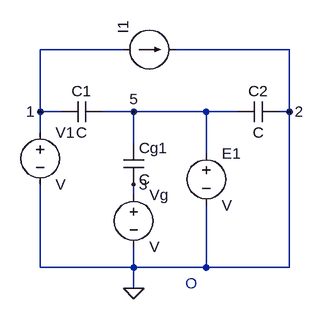
[diagram p0: schematic modeloUnSet.asc]
modeloUnSet.asc, the LTspice schematic file:
Version 4
SHEET 1 880 680
WIRE 128 80 0 80
WIRE 384 80 208 80
WIRE 0 176 0 80
WIRE 32 176 0 176
WIRE 144 176 96 176
WIRE 256 176 144 176
WIRE 304 176 256 176
WIRE 384 176 384 80
WIRE 384 176 368 176
WIRE 0 208 0 176
WIRE 144 224 144 176
WIRE 256 240 256 176
WIRE 144 304 144 288
WIRE 0 416 0 288
WIRE 144 416 144 384
WIRE 144 416 0 416
WIRE 256 416 256 320
WIRE 256 416 144 416
WIRE 384 416 384 176
WIRE 384 416 256 416
WIRE 144 448 144 416
FLAG 144 448 0
FLAG 0 176 1
FLAG 144 288 3
FLAG 144 176 5
FLAG 384 176 2
SYMBOL current 128 80 R270
WINDOW 123 0 0 Left 0
WINDOW 39 0 0 Left 0
SYMATTR InstName I1
SYMATTR Value ""
SYMBOL cap 96 160 R90
WINDOW 0 0 32 VBottom 2
WINDOW 3 32 32 VTop 2
SYMATTR InstName C1
SYMBOL cap 128 224 R0
SYMATTR InstName Cg1
SYMBOL cap 368 160 R90
WINDOW 0 0 32 VBottom 2
WINDOW 3 32 32 VTop 2
SYMATTR InstName C2
SYMBOL voltage 0 192 R0
SYMATTR InstName V1
SYMBOL voltage 144 288 R0
SYMATTR InstName Vg
SYMBOL voltage 256 224 R0
SYMATTR InstName E1
TEXT 224 440 Left 2 ;O

The netlist it stands for:
* modeloUnSet.asc
I1 1 0
C1 5 1 C
Cg1 5 3 C
C2 0 5 C
V1 1 0 V
Vg 3 0 V
V§E1 5 0 V
* O
.backanno
.end